# EAGLE design Sound Activation 2019 (EAGLE 8.2.0)
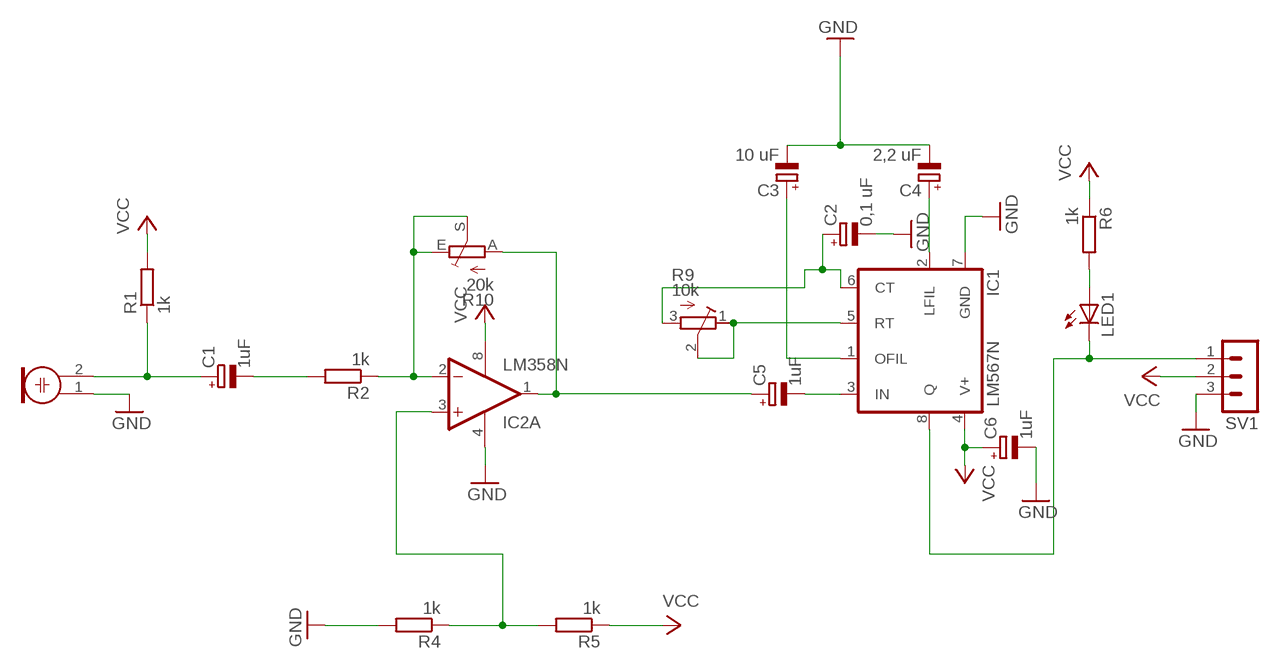
[diagram p0: schematic, sheet 1]

## Parts
C1  1uF  CPOL-EUE1.8-4  [E1,8-4]
C2  0,1 uF  CPOL-EUE1.8-4  [E1,8-4]
C3  10 uF  CPOL-EUE1.8-4  [E1,8-4]
C4  2,2 uF  CPOL-EUE1.8-4  [E1,8-4]
C5  1uF  CPOL-EUE1.8-4  [E1,8-4]
C6  1uF  CPOL-EUE1.8-4  [E1,8-4]
IC1  LM567N  [DIL08]
IC2  LM358N  [DIL08]
LED1  LED3MM  [LED3MM]
M1  ELECTRET_MICROPHON-F6050AP  [F6050AP]
R1  1k  R-EU_0204/7  [0204/7]
R2  1k  R-EU_0204/7  [0204/7]
R4  1k  R-EU_0204/7  [0204/7]
R5  1k  R-EU_0204/7  [0204/7]
R6  1k  R-EU_0204/7  [0204/7]
R9  10k  R-TRIMM3006P  [RTRIM3006P]
R10  20k  TRIM_EU-CA6V  [CA6V]
SV1  MA03-1  [MA03-1]

## Nets
GND: C2.- C3.- C4.- C6.- IC1.7(GND) IC2.4(P:V-) M1.1 R4.2 SV1.3
N$1: IC2.2(A:-IN) R2.1 R10.E R10.S
N$2: IC2.3(A:+IN) R4.1 R5.2
N$3: C1.+ M1.2 R1.1
N$4: C1.- R2.2
N$5: C2.+ IC1.6(CT) R9.3(A)
N$6: IC1.5(RT) R9.1(E) R9.2(S)
N$7: C5.+ IC2.1(A:OUT) R10.A
N$8: IC1.8(Q) LED1.K(C) SV1.1
N$9: LED1.A R6.2
N$10: C5.- IC1.3(IN)
N$12: C3.+ IC1.1(OFIL)
N$13: C4.+ IC1.2(LFIL)
VCC: C6.+ IC1.4(V+) IC2.8(P:V+) R1.2 R5.1 R6.1 SV1.2
Unconnected: IC2.5(B:+IN) IC2.6(B:-IN) IC2.7(B:OUT)

## Library data of the parts
C1-C6 = rcl:CPOL-EU: POLARIZED CAPACITOR, European symbol
IC1 = linear:*567: TONE DECODER
IC2 = linear:LM358: OP AMP also LM158; LM258; LM2904 Source: http://cache.national.com/ds/LM/LM158.pdf
LED1 = led:LED: LED OSRAM: - CHIPLED LG R971, LG N971, LY N971, LG Q971, LY Q971, LO R971, LY R971 LH N974, LH R974 LS Q976, LO Q976, LY Q976 LO Q996 - Hyper CHIPLED LW Q18S LB Q993, LB Q99A, LB R99A - SideLED LS A670, LO A670, LY A670, LG A670, LP A670 LB A673, LV A673, LT A673, LW A673 LH A674 LY A675 LS A676, LA A676, LO A676, LY A676, LW A676 LS A679, LY A679, LG A679 - Hyper Micro SIDELED® LS Y876, LA Y876, LO Y876, LY Y876 LT Y87S - SmartLED LW L88C, LW L88S LB L89C, LB L89S, LG L890 LS L89K, LO L89K, LY L89K LS L896, LA L896, LO L896, LY L896 - TOPLED LS T670, LO T670, LY T670, LG T670, LP T670 LSG T670, LSP T670, LSY T670, LOP T670, LYG T670 LG T671, LOG T671, LSG T671 LB T673, LV T673, LT T673, LW T673 LH T674 LS T676, LA T676, LO T676, LY T676, LB T676, LH T676, LSB T676, LW T676 LB T67C, LV T67C, LT T67C, LS T67K, LO T67K, LY T67K, LW E67C LS E67B, LA E67B, LO E67B, LY E67B, LB E67C, LV E67C, LT E67C LW T67C LS T679, LY T679, LG T679 LS T770, LO T770, LY T770, LG T770, LP T770 LB T773, LV T773, LT T773, LW T773 LH T774 LS E675, LA E675, LY E675, LS T675 LS T776, LA T776, LO T776, LY T776, LB T776 LHGB T686 LT T68C, LB T68C - Hyper Mini TOPLED® LB M676 - Mini TOPLED Santana® LG M470 LS M47K, LO M47K, LY M47K Source: http://www.osram.convergy.de LUXEON: - LUMILED® LXK2-PW12-R00, LXK2-PW12-S00, LXK2-PW14-U00, LXK2-PW14-V00 LXK2-PM12-R00, LXK2-PM12-S00, LXK2-PM14-U00 LXK2-PE12-Q00, LXK2-PE12-R00, LXK2-PE12-S00, LXK2-PE14-T00, LXK2-PE14-U00 LXK2-PB12-K00, LXK2-PB12-L00, LXK2-PB12-M00, LXK2-PB14-N00, LXK2-PB14-P00, LXK2-PB14-Q00 LXK2-PR12-L00, LXK2-PR12-M00, LXK2-PR14-Q00, LXK2-PR14-R00 LXK2-PD12-Q00, LXK2-PD12-R00, LXK2-PD12-S00 LXK2-PH12-R00, LXK2-PH12-S00 LXK2-PL12-P00, LXK2-PL12-Q00, LXK2-PL12-R00 Source: www.luxeon.com KINGBRIGHT: KA-3528ASYC Source: www.kingbright.com
M1 = microphon:ELECTRET_MICROPHON-: Electret Condenser Microphone
R1 R2 R4-R6 = rcl:R-EU_: RESISTOR, European symbol
R9 = rcl:R-TRIMM: Trimm resistor
R10 = pot:TRIM_EU-: POTENTIOMETER
SV1 = con-lstb:MA03-1: PIN HEADER; OC_FARNELL: unknown; OC_NEWARK: unknown

## Board
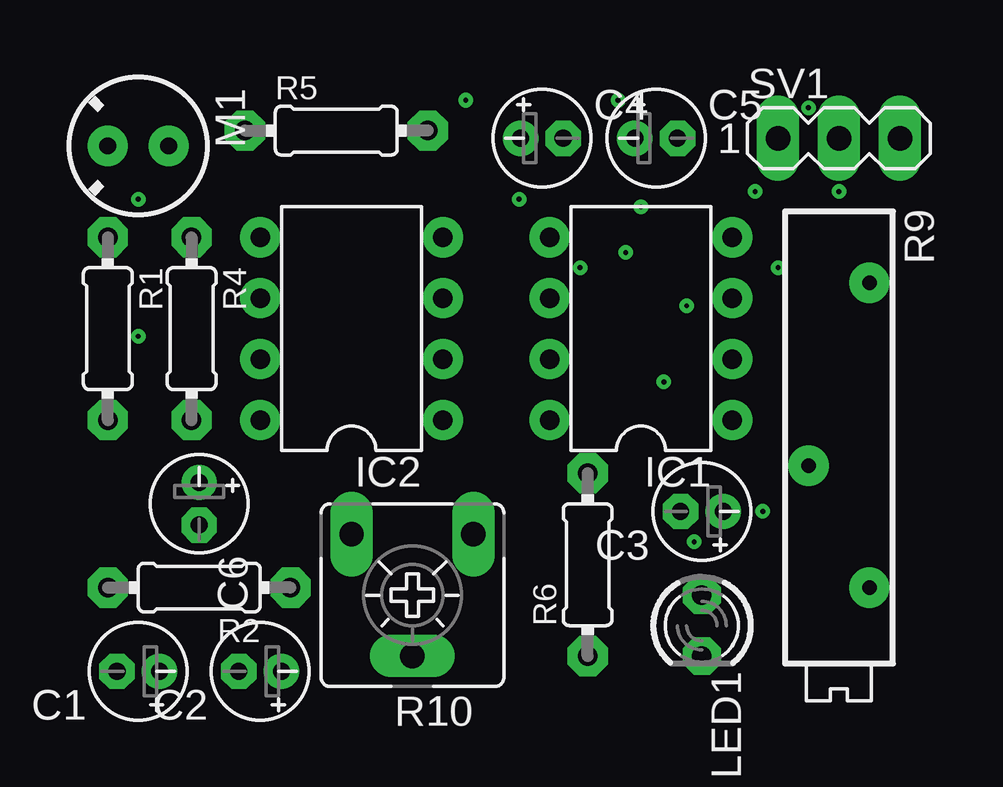
[diagram p1: board, top side]
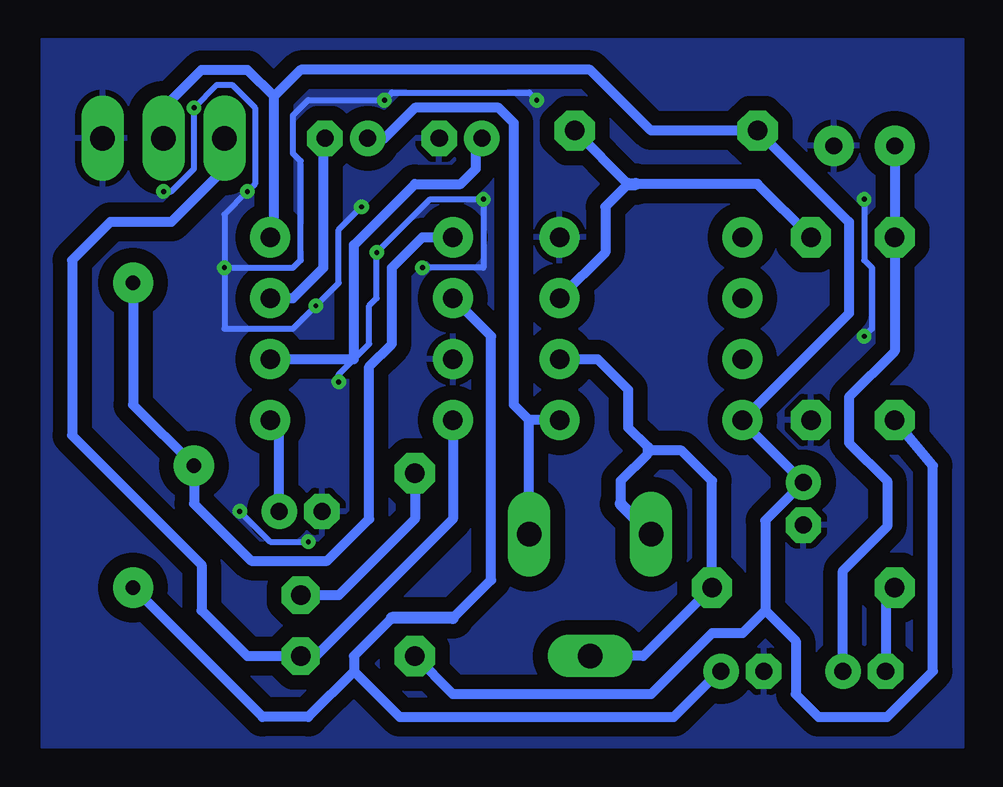
[diagram p2: board, bottom side, seen from below]

No outline drawn. Coordinates in mm, seen from the top.
Copper layers (1*16): Top 0.035mm / dielectric 1.5mm / Bottom 0.035mm
Design rules "default *": minimum track width 6mil, minimum drill 0.35mm, track to track 6mil, track to pad 6mil, pad to pad 6mil, via to via 6mil, smd to smd 6mil, copper to edge 40mil, drill to drill 6mil, minimum pad ring 15mil, minimum via ring 8mil, stop-mask expansion 4mil, vias tented up to drill 0mil, thermal gap 10mil

### Footprints (pad centres in the part's own frame; a part is rotated, then mirrored left to right if it is on the bottom)
E1,8-4 = drill 0.711 pad 1.422: + -0.889,0 | drill 0.711 pad 1.422 octagon: - 0.889,0
DIL08 = drill 0.813 pad 1.676: 1 -3.81,-3.81; 2 -1.27,-3.81; 3 1.27,-3.81; 4 3.81,-3.81; 5 3.81,3.81; 6 1.27,3.81; 7 -1.27,3.81; 8 -3.81,3.81
LED3MM = drill 0.813 octagon: A -1.27,0; K 1.27,0
F6050AP = drill 0.7 pad 1.676: 1 0,1.27; 2 0,-1.27
0204/7 = drill 0.813 pad 1.676 octagon: 1 -3.81,0; 2 3.81,0
RTRIM3006P = drill 0.61 pad 1.676: 1 -7.62,1.27; 2 0,-1.27; 3 5.08,1.27
CA6V = drill 1.016 long: A -2.54,-2.54; E 2.54,-2.54; S 0,2.54
MA03-1 = drill 1.016 long: 1 -2.54,0; 2 0,0; 3 2.54,0

### Placement (x,y rotation side)
C1  21.91,14.29 180 top
C2  26.99,14.29 180 top
C3  45.4,20.95 180 top
C4  38.73,36.51 0 top
C5  43.5,36.51 0 top
C6  24.45,21.27 270 top
IC1  42.86,28.57 90 top
IC2  30.8,28.57 90 top
LED1  45.4,16.19 270 top
M1  21.91,36.2 270 top
R1  20.64,28.57 270 top
R2  24.45,17.78 180 top
R4  24.13,28.57 270 top
R5  30.16,36.83 0 top
R6  40.64,18.73 90 top
R9  51.12,22.86 270 top
R10  33.34,17.46 180 top
SV1  51.12,36.51 0 top

### Tracks (layer width: path | path; a pad name or v marks a point on that pad's centre or on a via)
GND  (via drill 0.2)
  Bottom 0.254: v51.12,34.29 50.8,34.29 49.85,35.24 v49.85,37.78 48.9,38.73 48.26,38.73 47.31,37.78 47.31,34.61 v47.62,34.29 48.58,33.34 v48.58,31.11 | v48.58,31.11 45.72,31.11 45.4,31.43 45.4,35.56 45.72,35.88 45.72,37.47 45.09,38.1 v41.91,38.1 41.59,38.42 35.88,38.42 v35.56,38.1 | v21.91,33.97 21.91,31.43 21.59,31.11 21.59,28.57 v21.91,28.26 | v47.94,20.95 46.67,19.68 v45.09,19.68 | v43.81,26.35 43.81,26.67 42.55,27.94 42.55,29.53 42.23,29.84 v42.23,31.75 40.01,33.97 v37.78,33.97 37.78,31.11 v40.32,31.11 | v42.86,33.66 43.81,32.7 43.81,30.48 v44.77,29.53 45.72,28.57 48.58,28.57 v48.58,31.11
  pour Bottom (isolate 0.61): 17.78,40.64 56.2,40.64 56.2,11.11 17.78,11.11
N$1
  Bottom 0.406: 30.96,23.65 30.8,23.5 29.53,23.5 28.26,22.23 R2.1 31.11,14.92 R10.S | 32.07,21.27 32.07,22.23 30.96,23.34 30.96,23.65 | IC2.2 33.02,27.3 31.75,26.04 31.75,24.45 30.96,23.65
  Bottom 0.508: R10.E 32.07,21.27
N$2
  Bottom 0.406: R5.2 31.75,34.61 | 31.75,34.61 31.43,34.61 26.35,34.61 R4.1 | 31.75,34.61 32.7,33.66 32.7,31.75 IC2.3
  Bottom 0.508: 31.75,34.61 31.43,34.61
N$3
  Bottom 0.406: M1.2 R1.1 20.64,27.62 22.54,25.72 22.54,23.81 20.95,22.23 20.95,20.32 22.8,18.48 C1.+
N$4
  Bottom 0.406: R2.2 21.02,17.4 C1.-
N$5
  Bottom 0.406: IC1.6 37.47,28.26 37.47,18.1 39.05,16.51 | 41.59,16.51 43.18,14.92 43.18,14.29 | 43.18,14.29 45.09,12.38 46.99,12.38 R9.3 | 43.18,14.29 41.27,12.38 29.84,12.38 27.94,14.29 C2.+
  Bottom 0.508: 39.05,16.51 41.59,16.51
N$6
  Bottom 0.406: R9.1 52.39,25.4 R9.2 49.85,21.27 47.47,18.89 44.29,18.89 42.55,20.64 42.55,26.99 41.59,27.94 41.59,31.11 40.32,32.38 IC1.5
N$7
  Bottom 0.406: R10.A 35.88,24.77 | C5.+ 41.91,36.51 40.64,37.78 37.15,37.78 36.51,37.15 36.51,25.4 35.88,24.77 | IC2.1 35.88,24.77
N$8
  Bottom 0.406: IC1.8 39.05,20.64 44.77,14.92 LED1.K 47.62,14.92 49.53,16.83 49.53,18.73 54.93,24.13 54.93,31.43 53.34,33.02 50.8,33.02 48.58,35.24 SV1.1
N$9
  Bottom 0.406: LED1.A 43.81,17.46 40.64,20.64 R6.2
N$10
  Bottom 0.406: IC1.3 45.72,29.84 44.45,31.11 44.45,35.56 | 44.45,35.56 44.45,35.88 | 44.45,35.56 44.45,36.45 C5.-
N$12
  Bottom 0.406: C3.+ 46.29,24.38 IC1.1
N$13
  Bottom 0.406: IC1.2 43.18,27.3 43.18,32.07 40.64,34.61 38.73,34.61 38.1,35.24 38.1,36.26 C4.+
VCC
  Bottom 0.406: R1.2 19.05,22.86 19.05,14.29 20.95,12.38 23.81,12.38 24.77,13.34 24.77,15.56 26.04,16.83 | 46.51,38.26 45.4,39.37 33.34,39.37 30.8,36.83 R5.1 22.54,33.02 22.54,29.21 IC2.8 26.99,24.7 C6.+ 26.04,20.57 26.04,16.83 | IC1.4 46.51,32.54 46.51,38.26 | 46.51,38.26 47.62,39.37 49.53,39.37 51.12,37.78 SV1.2 | 26.04,16.83 26.99,15.88 28.26,15.88 30.8,13.34 39.05,13.34 R6.1